# EAGLE design input (EAGLE 5.10)
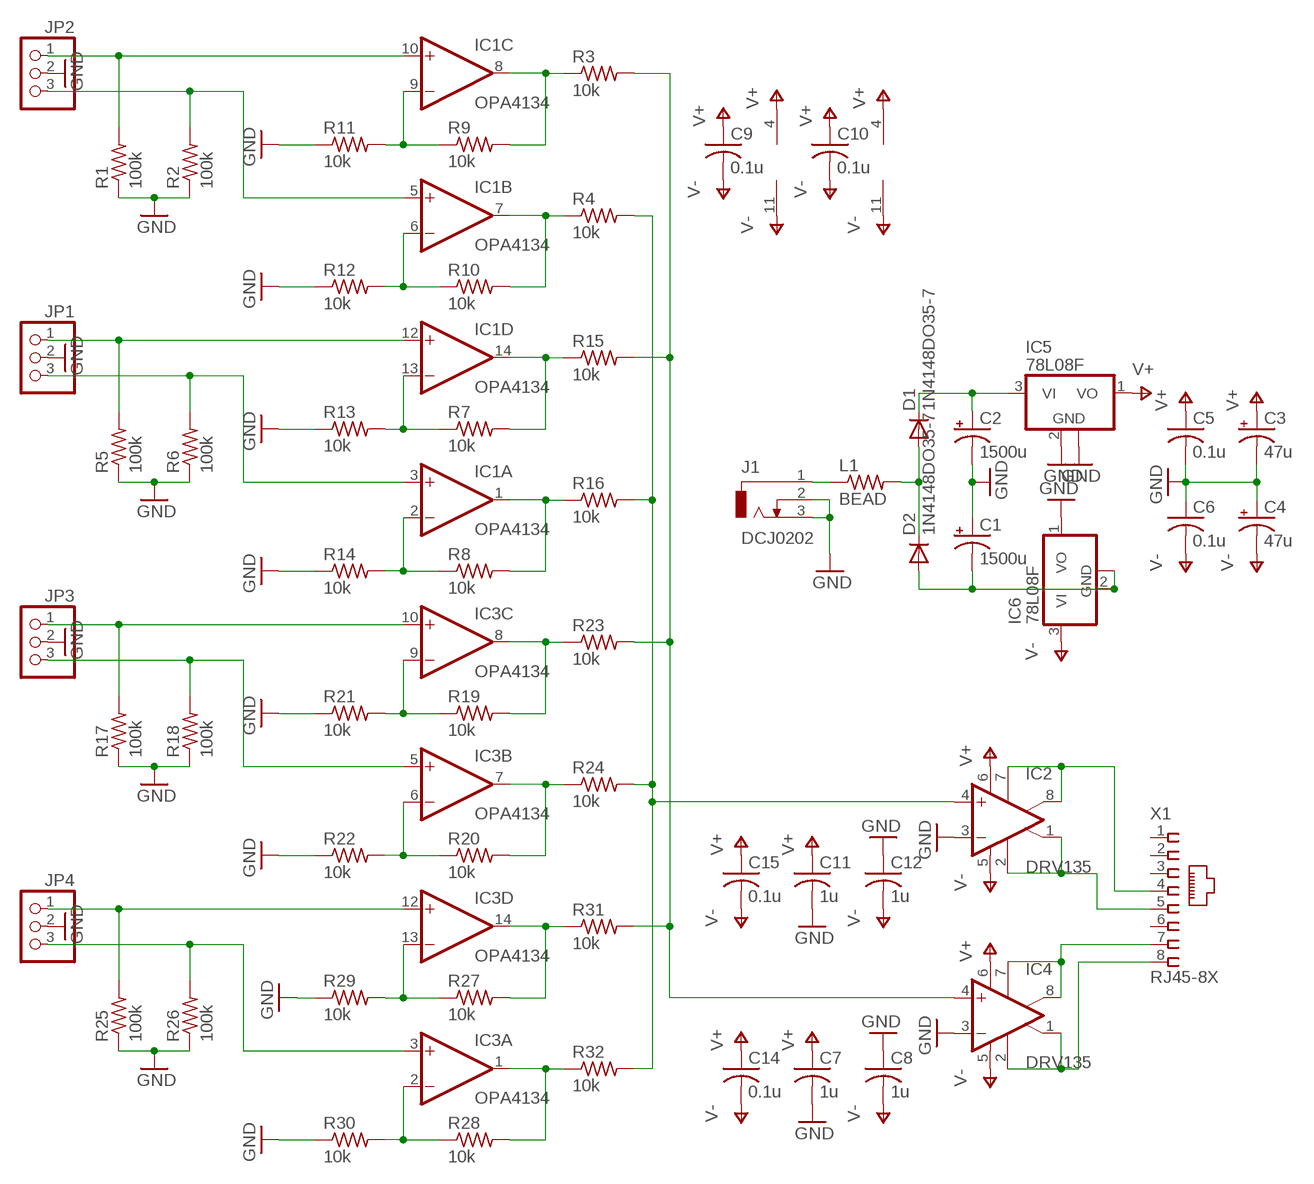
[diagram p0: schematic, sheet 1]

## Parts
C1  1500u  CPOL-USE3.5-10  [E3,5-10]
C2  1500u  CPOL-USE3.5-10  [E3,5-10]
C3  47u  CPOL-USE2-5  [E2-5]
C4  47u  CPOL-USE2-5  [E2-5]
C5  0.1u  C-USC0805  [C0805]
C6  0.1u  C-USC0805  [C0805]
C7  1u  C-USC0805  [C0805]
C8  1u  C-USC0805  [C0805]
C9  0.1u  C-USC0805  [C0805]
C10  0.1u  C-USC0805  [C0805]
C11  1u  C-USC0805  [C0805]
C12  1u  C-USC0805  [C0805]
C14  0.1u  C-USC0805  [C0805]
C15  0.1u  C-USC0805  [C0805]
D1  1N4148DO35-7  [DO35-7]
D2  1N4148DO35-7  [DO35-7]
IC1  OPA4134  TL084D  [SO14]
IC2  DRV135  THAT1646  [SO8]
IC3  OPA4134  TL084D  [SO14]
IC4  DRV135  THAT1646  [SO8]
IC5  78L08F  [SOT89]
IC6  78L08F  [SOT89]
J1  DCJ0202  [DCJ0202]
JP1  PINHD-1X3  [1X03]
JP2  PINHD-1X3  [1X03]
JP3  PINHD-1X3  [1X03]
JP4  PINHD-1X3  [1X03]
L1  BEAD  R-US_R1206  [R1206]
R1  100k  R-US_R0805  [R0805]
R2  100k  R-US_R0805  [R0805]
R3  10k  R-US_R0805  [R0805]
R4  10k  R-US_R0805  [R0805]
R5  100k  R-US_R0805  [R0805]
R6  100k  R-US_R0805  [R0805]
R7  10k  R-US_R0805  [R0805]
R8  10k  R-US_R0805  [R0805]
R9  10k  R-US_R0805  [R0805]
R10  10k  R-US_R0805  [R0805]
R11  10k  R-US_R0805  [R0805]
R12  10k  R-US_R0805  [R0805]
R13  10k  R-US_R0805  [R0805]
R14  10k  R-US_R0805  [R0805]
R15  10k  R-US_R0805  [R0805]
R16  10k  R-US_R0805  [R0805]
R17  100k  R-US_R0805  [R0805]
R18  100k  R-US_R0805  [R0805]
R19  10k  R-US_R0805  [R0805]
R20  10k  R-US_R0805  [R0805]
R21  10k  R-US_R0805  [R0805]
R22  10k  R-US_R0805  [R0805]
R23  10k  R-US_R0805  [R0805]
R24  10k  R-US_R0805  [R0805]
R25  100k  R-US_R0805  [R0805]
R26  100k  R-US_R0805  [R0805]
R27  10k  R-US_R0805  [R0805]
R28  10k  R-US_R0805  [R0805]
R29  10k  R-US_R0805  [R0805]
R30  10k  R-US_R0805  [R0805]
R31  10k  R-US_R0805  [R0805]
R32  10k  R-US_R0805  [R0805]
X1  RJ45-8X  [RJ45-NO-SHIELD]

## Nets
GND: C1.+ C2.- C3.- C4.+ C5.2 C6.1 C7.2 C8.1 C11.2 C12.1 IC2.3(-IN) IC4.3(-IN) IC5.2(GND) IC5.2@1(GND) IC6.1(VO) J1.2 J1.3 JP1.2 JP2.2 JP3.2 JP4.2 R1.1 R2.1 R5.1 R6.1 R11.1 R12.1 R13.1 R14.1 R17.1 R18.1 R21.1 R22.1 R25.1 R26.1 R29.1 R30.1
N$1: IC1.10(C:+IN) JP2.1 R1.2
N$2: IC1.5(B:+IN) JP2.3 R2.2
N$3: C2.+ D1.C IC5.3(VI)
N$4: D1.A D2.C L1.2
N$5: IC1.12(D:+IN) JP1.1 R5.2
N$6: IC1.3(A:+IN) JP1.3 R6.2
N$7: C1.- D2.A IC6.2(GND) IC6.2@1(GND)
N$9: IC1.13(D:-IN) R7.1 R13.2
N$10: IC1.2(A:-IN) R8.1 R14.2
N$11: IC1.14(D:OUT) R7.2 R15.1
N$12: IC1.1(A:OUT) R8.2 R16.1
N$13: IC4.4(+IN) R3.2 R15.2 R23.2 R31.2
N$14: IC2.4(+IN) R4.2 R16.2 R24.2 R32.2
N$15: IC3.10(C:+IN) JP3.1 R17.2
N$16: IC3.5(B:+IN) JP3.3 R18.2
N$17: IC1.9(C:-IN) R9.1 R11.2
N$18: IC1.6(B:-IN) R10.1 R12.2
N$19: IC1.8(C:OUT) R3.1 R9.2
N$20: IC1.7(B:OUT) R4.1 R10.2
N$23: IC3.9(C:-IN) R19.1 R21.2
N$24: IC3.6(B:-IN) R20.1 R22.2
N$25: IC3.8(C:OUT) R19.2 R23.1
N$26: IC3.7(B:OUT) R20.2 R24.1
N$27: IC3.12(D:+IN) JP4.1 R25.2
N$28: IC3.3(A:+IN) JP4.3 R26.2
N$31: IC3.13(D:-IN) R27.1 R29.2
N$32: IC3.2(A:-IN) R28.1 R30.2
N$33: IC3.14(D:OUT) R27.2 R31.1
N$34: IC3.1(A:OUT) R28.2 R32.1
N$35: IC4.1(OUT-) IC4.2(SNS-) X1.8
N$36: IC4.7(SNS+) IC4.8(OUT+) X1.7
N$37: IC2.7(SNS+) IC2.8(OUT+) X1.4
N$38: IC2.1(OUT-) IC2.2(SNS-) X1.5
N$42: J1.1 L1.1
V+: C3.+ C5.1 C7.1 C9.1 C10.1 C11.1 C14.1 C15.1 IC1.4(P:V+) IC2.6(V+) IC3.4(P:V+) IC4.6(V+) IC5.1(VO)
V-: C4.- C6.2 C8.2 C9.2 C10.2 C12.2 C14.2 C15.2 IC1.11(P:V-) IC2.5(V-) IC3.11(P:V-) IC4.5(V-) IC6.3(VI)
Unconnected: X1.1 X1.2 X1.3 X1.6

## Library data of the parts
C1-C4 = rcl:CPOL-US: POLARIZED CAPACITOR, American symbol
C5-C12 C14 C15 = rcl:C-US: CAPACITOR, American symbol
D1 D2 = diode:1N4148: DIODE high speed (Philips)
IC1 IC3 = linear:TL084: OP AMP
IC2 IC4 = that:THAT1646
IC5 IC6 = linear:78L*: POSITOIV-VOLTAGE REGULATORS Output up to 100 mA Source: http://focus.ti.com/lit/ds/symlink/ua78l05.pdf
J1 = con-jack:DCJ0202: DC POWER JACK Source: DCJ0202.pdf
JP1-JP4 = pinhead:PINHD-1X3: PIN HEADER
L1 = rcl:R-US_: RESISTOR, American symbol
R1-R32 = resistor:R-US_: RESISTOR, American symbol
X1 = con-tycoelectronics:RJ45: CORCOM Modular RJ Jacks No Shield Source: www.tycoelectronics.com .. ENG_DS_1654001_1099_RJ_L_0507.pdf

## Board
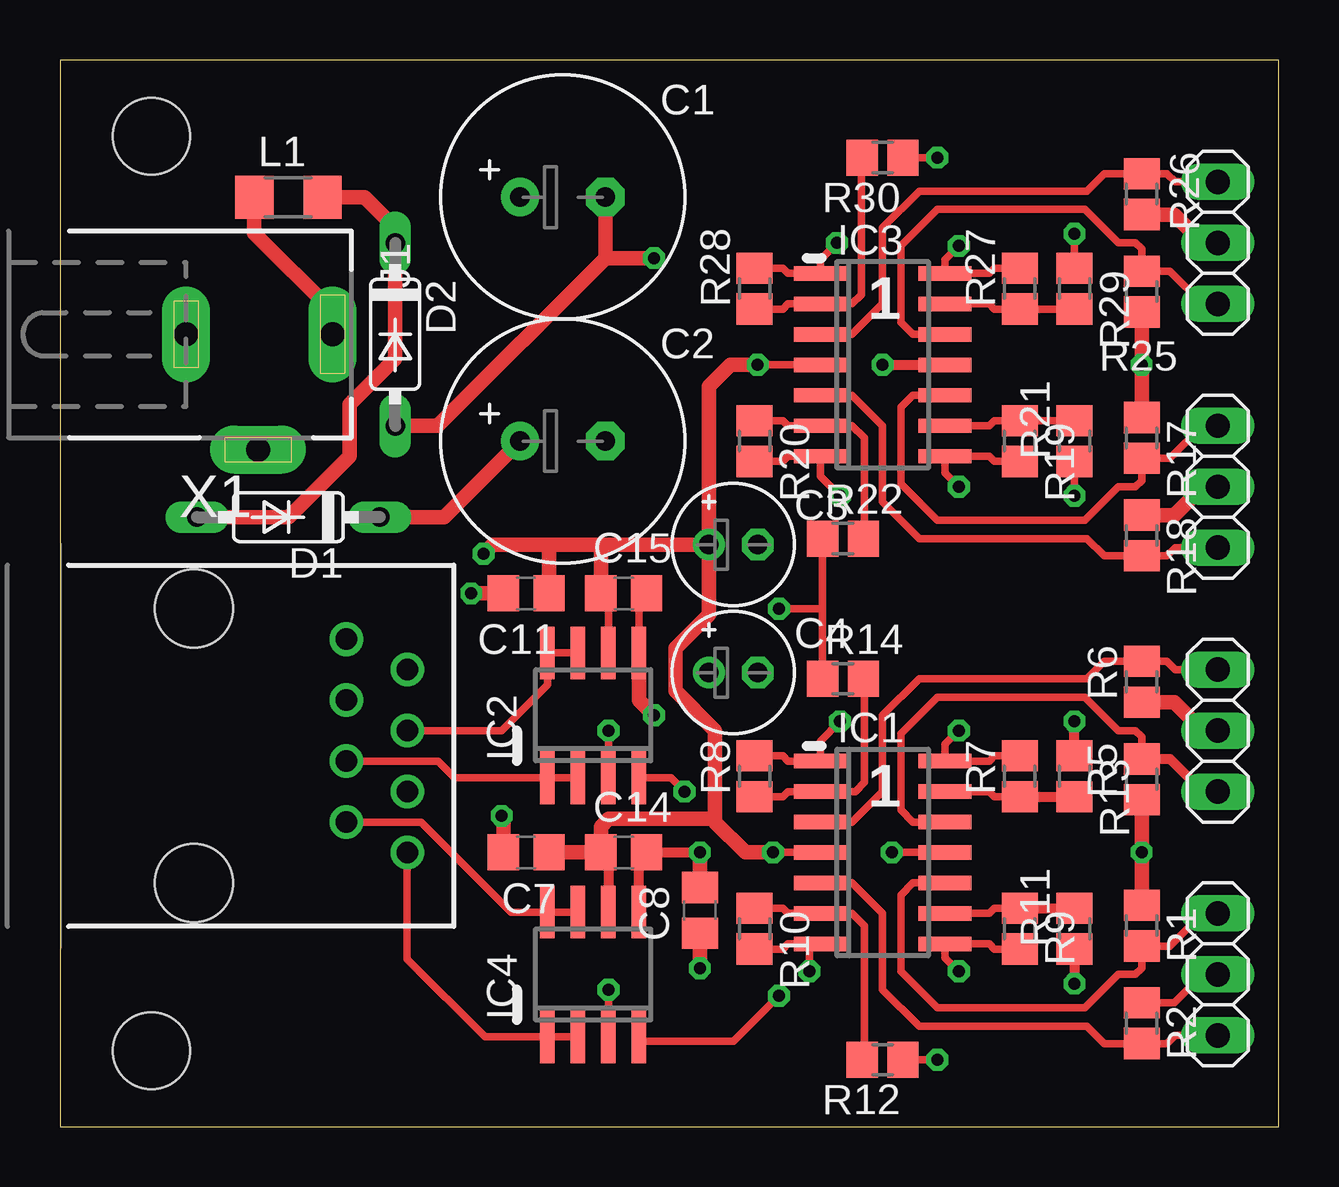
[diagram p1: board, top side]
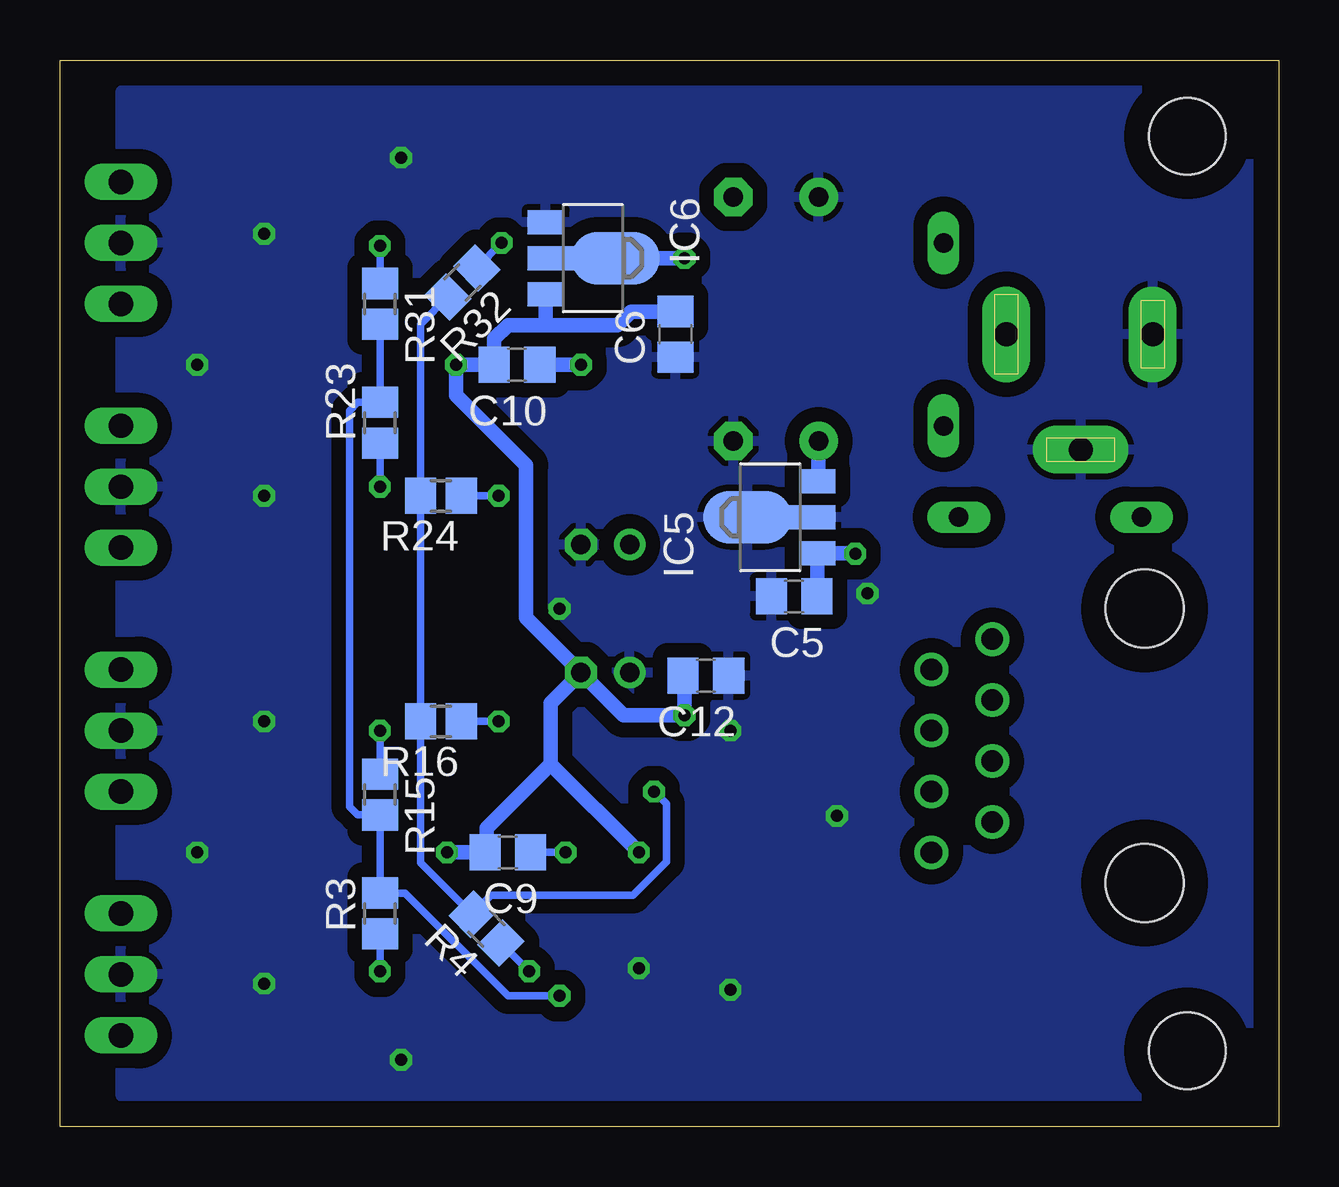
[diagram p2: board, bottom side, seen from below]

Size 50.8 x 44.45 mm. Coordinates in mm from the lower left corner, seen from the top.
Outline: 50.8,44.45 0,44.45 0,0 50.8,0 50.8,44.45
Copper layers (1*16): Top 0.035mm / dielectric 1.5mm / Bottom 0.035mm
Design rules "default *": minimum track width 10mil, minimum drill 18mil, track to track 12mil, track to pad 12mil, pad to pad 12mil, via to via 12mil, smd to smd 12mil, copper to edge 40mil, drill to drill 8mil, minimum pad ring 10mil, minimum via ring 8mil, stop-mask expansion 4mil, vias tented up to drill 0mil, thermal gap 10mil
Holes 3.2 mm at 3.81,3.17 3.81,41.27

### Footprints (pad centres in the part's own frame; a part is rotated, then mirrored left to right if it is on the bottom)
E3,5-10 = drill 0.813 pad 1.6 round: + -1.778,0 | drill 0.813 pad 1.6 octagon: - 1.778,0
E2-5 = drill 0.813 pad 1.27 round: + -1.016,0 | drill 0.813 pad 1.27 octagon: - 1.016,0
C0805 = smd 1.3 x 1.5: 1 -0.95,0; 2 0.95,0
DO35-7 = drill 0.813 long: A 3.81,0; C -3.81,0
SO14 = smd 0.6 x 2.2: 1 -3.81,-2.6; 2 -2.54,-2.6; 3 -1.27,-2.6; 4 0,-2.6; 5 1.27,-2.6; 6 2.54,-2.6; 7 3.81,-2.6; 8 3.81,2.6; 9 2.54,2.6; 10 1.27,2.6; 11 0,2.6; 12 -1.27,2.6; 13 -2.54,2.6; 14 -3.81,2.6
SO8 = smd 0.6 x 2.2: 1 -1.905,-2.6; 2 -0.635,-2.6; 3 0.635,-2.6; 4 1.905,-2.6; 5 1.905,2.6; 6 0.635,2.6; 7 -0.635,2.6; 8 -1.905,2.6
SOT89 = smd 1 x 1.5: 1 -1.499,-1.981; 3 1.499,-1.981 | smd 1 x 2: 2 0,-1.727 | smd 2.2 x 3.7: 2@1 0,0.94
DCJ0202 = drill 1 pad 2 long: 1 0,3.1; 2 4.8,0; 3 0,-3
1X03 = drill 1.016 long: 1 -2.54,0; 2 0,0; 3 2.54,0
R1206 = smd 1.6 x 1.803: 1 -1.422,0; 2 1.422,0
R0805 = smd 1.3 x 1.5: 1 -0.85,0; 2 0.85,0
RJ45-NO-SHIELD = drill 0.9 pad 1.4 round: 1 -4.445,6.35; 2 -3.175,8.89; 3 -1.905,6.35; 4 -0.635,8.89; 5 0.635,6.35; 6 1.905,8.89; 7 3.175,6.35; 8 4.445,8.89 | hole 3.251: -5.715,0; 5.715,0

### Placement (x,y rotation side)
C1  20.95,38.73 0 top
C2  20.95,28.57 0 top
C3  28.07,24.26 0 top
C4  28.07,18.92 0 top
C5  20.19,22.1 180 bottom
C6  25.15,33.02 90 bottom
C7  19.43,11.43 180 top
C8  26.67,9.02 90 top
C9  32.13,11.43 180 bottom
C10  31.75,31.75 180 bottom
C11  19.43,22.23 180 top
C12  23.88,18.8 180 bottom
C14  23.49,11.43 0 top
C15  23.49,22.23 0 top
D1  9.53,25.4 180 top
D2  13.97,33.02 270 top
IC1  34.29,11.43 270 top
IC2  22.22,17.14 0 top
IC3  34.29,31.75 270 top
IC4  22.22,6.35 0 top
IC5  21.21,25.4 90 bottom
IC6  28.57,36.2 270 bottom
J1  8.25,33.02 270 top
JP1  48.26,16.51 90 top
JP2  48.26,6.35 270 top
JP3  48.26,26.67 270 top
JP4  48.26,36.83 90 top
L1  9.53,38.73 0 top
R1  45.09,8.38 270 top
R2  45.09,4.32 270 top
R3  37.46,8.89 90 bottom
R4  33.02,8.26 135 bottom
R5  45.09,14.48 90 top
R6  45.09,18.54 90 top
R7  40.01,14.61 90 top
R8  28.96,14.61 90 top
R9  40.01,8.26 270 top
R10  28.96,8.26 270 top
R11  42.29,8.26 90 top
R12  34.29,2.79 180 top
R13  42.29,14.61 270 top
R14  32.64,18.67 0 top
R15  37.46,13.84 270 bottom
R16  34.92,16.89 180 bottom
R17  45.09,28.7 270 top
R18  45.09,24.64 270 top
R19  40.01,28.57 270 top
R20  28.96,28.57 270 top
R21  42.29,28.57 90 top
R22  32.64,24.51 0 top
R23  37.46,29.34 90 bottom
R24  34.92,26.29 180 bottom
R25  45.09,34.8 90 top
R26  45.09,38.86 90 top
R27  40.01,34.92 90 top
R28  28.96,34.92 90 top
R29  42.29,34.92 270 top
R30  34.29,40.39 180 top
R31  37.46,34.29 270 bottom
R32  34.04,35.18 225 bottom
X1  5.59,15.88 270 top

### Tracks (layer width: path | path; a pad name or v marks a point on that pad's centre or on a via)
GND  (via drill 0.5)
  Top 0.305: R2.1 46.44,5.17 47.62,6.35 JP2.2 | R12.1 v36.58,2.79 | R21.1 v42.29,26.29 | R30.1 v36.58,40.39 | R29.1 v42.29,37.21 | IC2.3 v22.86,16.51 | IC4.3 v22.86,5.71 | 31.79,21.59 R22.1 | R14.1 31.79,21.59 | 31.79,21.59 v29.97,21.59
  Top 0.406: R13.1 v42.29,16.89 | R11.1 v42.29,5.97
  Top 0.61: R6.1 46.44,17.69 47.62,16.51 JP1.2 | R1.1 v45.09,11.43 R5.1 | R18.1 46.44,25.49 47.62,26.67 JP3.2 | R26.1 46.44,38.01 47.62,36.83 JP4.2 | R25.1 v45.09,31.75 R17.1 | v17.14,22.23 C11.2 | C7.2 18.48,12.95 v18.41,12.95 | v26.67,6.6 C8.1
  pour Bottom (isolate 0.61): 1.27,1.27 48.26,1.27 48.26,43.18 1.27,43.18
N$1
  Top 0.305: IC1.10 35.56,10.16 35.05,9.65 35.05,6.48 36.58,4.95 42.71,4.95 44.11,6.35 44.83,6.35 45.09,6.6 R1.2 46.27,7.53 47.62,8.89 JP2.1
N$2
  Top 0.305: IC1.5 33.02,10.16 34.29,8.89 34.29,5.71 35.81,4.19 42.8,4.19 43.52,3.47 R2.2 46.14,3.47 46.48,3.81 JP2.3
N$3
  Top 0.61: D1.C 16,25.4 C2.+
  Bottom 0.61: IC5.3 19.18,26.9 C2.+
N$4
  Top 0.61: L1.2 12.7,38.73 13.97,37.47 D2.C 13.97,32 12.07,30.1 12.07,27.94 9.53,25.4 D1.A
N$5
  Top 0.305: IC1.12 35.56,12.7 35.05,13.21 35.05,16.38 36.58,17.91 42.71,17.91 44.11,16.51 44.83,16.51 45.09,16.26 R5.2
  Top 0.406: R5.2 46.27,15.33 47.62,13.97 JP1.1
N$6
  Top 0.305: IC1.3 33.02,12.7 34.29,13.97 34.29,17.14 35.81,18.67 42.8,18.67 43.52,19.39 R6.2 46.14,19.39 46.48,19.05 JP1.3
N$7  (via drill 0.5)
  Top 0.61: 22.73,36.2 v24.77,36.2 | 22.73,36.2 C1.- | D2.A 15.75,29.21 22.73,36.2
  Bottom 0.61: IC6.2 IC6.2@1 v24.77,36.2
N$9
  Top 0.305: R7.1 38.95,13.76 38.73,13.97 IC1.13
  Top 0.406: R7.1 R13.2
N$10
  Top 0.305: R8.1 30.14,13.76 30.35,13.97 IC1.2 33.15,13.97 33.53,14.35 33.53,18.67 R14.2
N$11  (via drill 0.5)
  Top 0.305: R7.2 38.95,15.46 38.73,15.24 IC1.14 36.89,15.94 v37.46,16.51
  Bottom 0.305: R15.1 v37.46,16.51
N$12  (via drill 0.5)
  Top 0.305: R8.2 30.14,15.46 30.35,15.24 IC1.1 31.69,16.07 v32.51,16.89
  Bottom 0.305: v32.51,16.89 R16.1
N$13  (via drill 0.5)
  Top 0.305: IC4.4 24.13,3.56 28.07,3.56 v29.97,5.46
  Bottom 0.305: R31.2 R23.2 38.39,30.19 38.73,29.84 38.73,13.34 38.39,12.99 R15.2 R3.2 36.41,9.74 32.13,5.46 v29.97,5.46
N$14  (via drill 0.5)
  Top 0.305: IC2.4 25.46,14.54 v26.04,13.97
  Bottom 0.305: R32.2 35.77,33.44 R24.2 R16.2 35.77,11.01 R4.2 32.83,9.65 26.92,9.65 25.53,11.05 25.53,13.46 v26.04,13.97
N$15
  Top 0.305: IC3.10 35.56,30.48 35.05,29.97 35.05,26.8 36.58,25.27 42.71,25.27 44.11,26.67 44.83,26.67 45.09,26.92 R17.2 46.27,27.85 47.62,29.21 JP3.1
N$16
  Top 0.305: IC3.5 33.02,30.48 34.29,29.21 34.29,26.04 35.81,24.51 42.8,24.51 43.52,23.79 R18.2 46.14,23.79 46.48,24.13 JP3.3
N$17
  Top 0.305: R9.1 38.95,9.11 38.73,8.89 IC1.9
  Top 0.406: R9.1 R11.2
N$18
  Top 0.305: R10.1 30.14,9.11 30.35,8.89 IC1.6 33.02,8.89 33.53,8.38 33.53,2.79 R12.2
N$19  (via drill 0.5)
  Top 0.305: R9.2 38.95,7.41 38.73,7.62 IC1.8 36.89,7.05 v37.46,6.48
  Bottom 0.305: v37.46,6.48 R3.1
N$20  (via drill 0.5)
  Top 0.305: R10.2 30.14,7.41 30.35,7.62 31.24,7.62 | 31.24,7.62 v31.24,6.48 | 31.24,7.62 IC1.7
  Bottom 0.305: v31.24,6.48 R4.1 | v31.24,6.48
N$23
  Top 0.305: IC3.9 38.73,29.21 38.95,29.43 R19.1 R21.2
N$24
  Top 0.305: R20.1 30.14,29.43 30.35,29.21 IC3.6 33.02,29.21 33.53,28.7 33.53,24.51 R22.2
N$25  (via drill 0.5)
  Top 0.305: R19.2 38.95,27.73 38.73,27.94 IC3.8 36.89,27.25 v37.46,26.67
  Bottom 0.305: v37.46,26.67 R23.1
N$26  (via drill 0.5)
  Top 0.305: R20.2 30.14,27.73 30.35,27.94 IC3.7 31.69,27.11 v32.51,26.29
  Bottom 0.305: v32.51,26.29 R24.1
N$27
  Top 0.305: IC3.12 35.56,33.02 35.05,33.53 35.05,36.7 36.58,38.23 42.71,38.23 44.11,36.83 44.83,36.83 45.09,36.58 R25.2 46.27,35.65 47.62,34.29 JP4.1
N$28
  Top 0.305: IC3.3 33.02,33.02 34.29,34.29 34.29,37.47 35.81,38.99 42.8,38.99 43.52,39.71 R26.2 46.14,39.71 46.48,39.37 JP4.3
N$31
  Top 0.305: IC3.13 38.73,34.29 38.95,34.08 R27.1 R29.2
N$32
  Top 0.305: R28.1 30.14,34.08 30.35,34.29 IC3.2 33.02,34.29 33.4,34.67 33.4,40.39 R30.2
N$33  (via drill 0.5)
  Top 0.305: R27.2 38.95,35.77 38.73,35.56 IC3.14 36.89,36.13 v37.46,36.7
  Bottom 0.305: R31.1 v37.46,36.7
N$34  (via drill 0.5)
  Top 0.305: R28.2 30.14,35.77 30.35,35.56 IC3.1 31.69,36.13 v32.38,36.83
  Bottom 0.305: v32.38,36.83 R32.1
N$35
  Top 0.305: IC4.2 IC4.1 17.71,3.75 14.48,6.99 X1.8
N$36
  Top 0.305: IC4.7 IC4.8 18.8,8.95 15.05,12.7 X1.7
N$37
  Top 0.305: IC2.7 IC2.8 20.32,18.41 18.41,16.51 X1.4
N$38
  Top 0.305: IC2.2 IC2.1 16.45,14.54 15.75,15.24 X1.5
N$42
  Top 0.61: J1.1 11.36,33.98 8.1,37.24 L1.1
V+  (via drill 0.5)
  Top 0.305: v29.08,31.75 IC3.4 | v29.72,11.43 IC1.4 | IC2.6 22.86,21.91 C15.1
  Top 0.406: IC4.6 22.86,11.43 C14.1 | C15.1 22.86,22.23
  Top 0.61: 27.3,12.83 27.3,12.7 28.57,11.43 v29.72,11.43 | 27.3,12.83 22.86,12.83 22.54,12.51 C14.1 C7.1 | v29.08,31.75 27.94,31.75 27.05,30.86 C3.+ | 27.3,12.83 27.3,16.51 25.65,18.16 25.65,19.94 27.05,21.34 C3.+ | 22.54,24.26 C15.1 | C3.+ 22.54,24.26 | v17.65,23.88 18.03,24.26 20.38,24.26 | 22.54,24.26 20.38,24.26 | 20.38,24.26 C11.1
  Bottom 0.305: v29.72,11.43 C9.1
  Bottom 0.61: v29.08,31.75 C10.1 | IC5.1 19.18,23.9 | IC5.1 17.65,23.9 v17.65,23.88 | IC5.1 19.23,22.1 C5.1
V-  (via drill 0.5)
  Top 0.305: v34.67,11.43 IC1.11 | IC2.5 24.13,21.91 C15.2
  Top 0.406: IC4.5 24.13,11.43 C14.2 v26.67,11.43 | v34.29,31.75 IC3.11
  Top 0.61: v24.77,17.14 24.13,17.78 IC2.5 | v26.67,11.43 C8.2
  Bottom 0.305: 33.02,11.43 C9.2
  Bottom 0.61: v34.67,11.43 33.02,11.43 33.02,12.45 30.35,15.11 | C6.2 26.99,33.97 27.56,33.4 30.56,33.4 | 30.56,33.4 IC6.3 | 30.56,33.4 32.13,33.4 32.7,32.83 C10.2 v34.29,31.75 34.29,30.48 31.37,27.56 31.37,21.21 C4.- | C4.- 27.3,17.14 v24.77,17.14 24.77,18.8 C12.2 | v26.67,11.43 30.35,15.11 | C4.- 30.35,17.65 30.35,15.11

### Text on the board
tPlace: 1 | 1